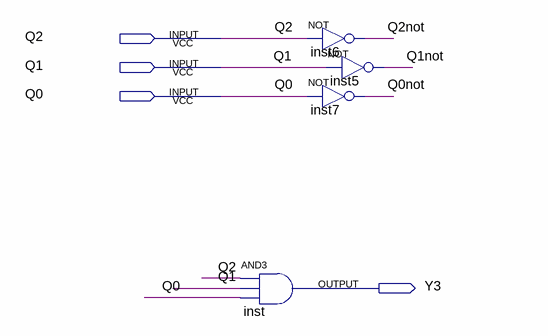
[diagram p0: schematic sheet]
// Quartus schematic Y3.bdf as structural Verilog: 4 symbols, 4 pins
module Y3 (
  input  Q2,
  input  Q1,
  input  Q0,
  output Y3
);

  wire Q0not, Q1not, Q2not;

  and inst (Y3, Q2, Q1, Q0);
  not inst6 (Q2not, Q2);
  not inst5 (Q1not, Q1);
  not inst7 (Q0not, Q0);
endmodule
